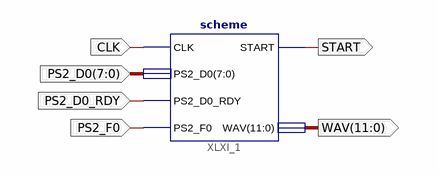
[diagram p0: schematic sheet 1]
// Xilinx ISE schematic fpga_synth.sch (spartan6) as structural Verilog: 1 symbols, 6 ports
module fpga_synth (
  input  CLK,
  input  [7:0] PS2_D0,
  input  PS2_D0_RDY,
  input  PS2_F0,
  output START,
  output [11:0] WAV
);

  scheme XLXI_1 (.CLK(CLK), .PS2_D0(PS2_D0), .PS2_D0_RDY(PS2_D0_RDY), .PS2_F0(PS2_F0), .START(START), .WAV(WAV));
endmodule
